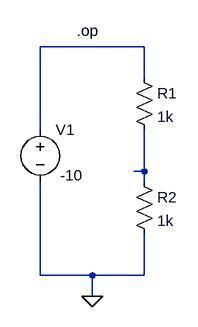
[diagram p0: schematic voltage_divider.asc]
voltage_divider.asc, the LTspice schematic file:
Version 4
SHEET 1 880 680
WIRE 160 -176 0 -176
WIRE 160 -128 160 -176
WIRE 0 -48 0 -176
WIRE 160 16 160 -48
WIRE 160 16 144 16
WIRE 160 32 160 16
WIRE 0 176 0 32
WIRE 80 176 0 176
WIRE 160 176 160 112
WIRE 160 176 80 176
WIRE 80 208 80 176
FLAG 80 208 0
DATAFLAG 144 -176 ""
DATAFLAG 160 16 ""
SYMBOL voltage 0 -64 R0
WINDOW 3 31 86 Left 2
WINDOW 123 0 0 Left 0
WINDOW 39 0 0 Left 0
SYMATTR InstName V1
SYMATTR Value -10
SYMBOL res 144 -144 R0
SYMATTR InstName R1
SYMATTR Value 1k
SYMBOL res 144 16 R0
SYMATTR InstName R2
SYMATTR Value 1k
TEXT 56 -200 Left 2 !.op

The netlist it stands for:
* voltage_divider.asc
V1 N001 0 -10
R1 N001 N002 1k
R2 N002 0 1k
.op
.backanno
.end